# EAGLE schematic Схема основной платы (EAGLE 6.5.0)
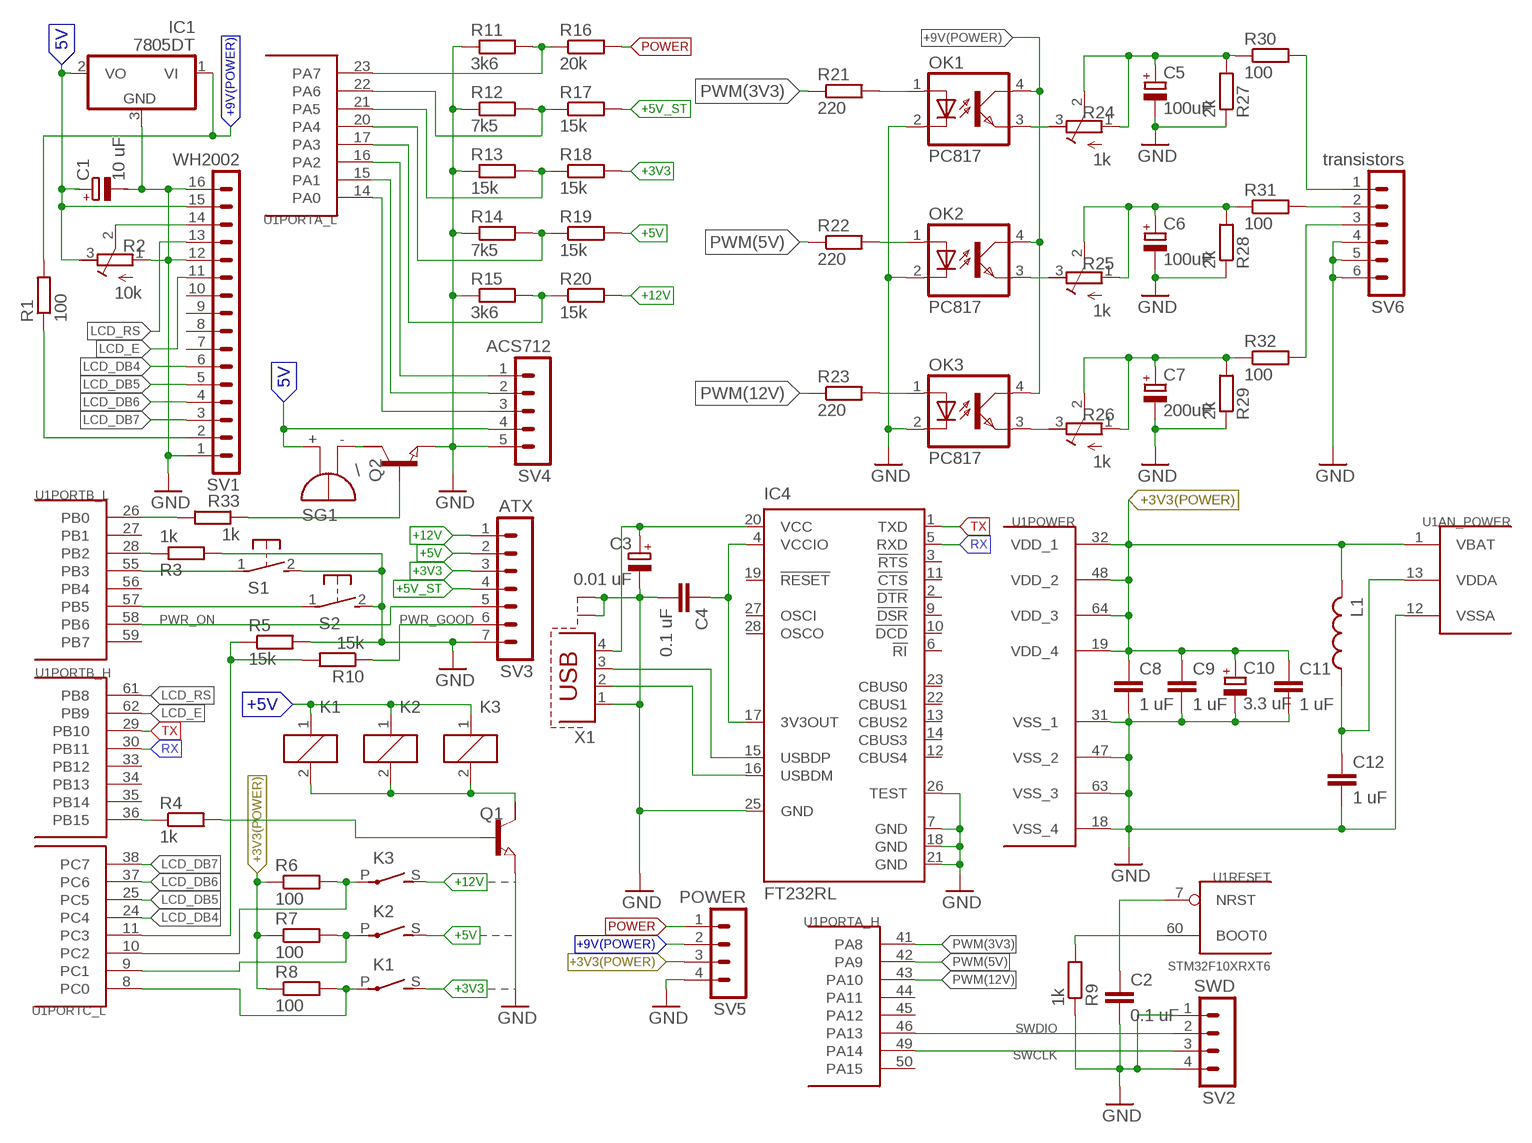
[diagram p0: schematic, sheet 1]

## Parts
C1  10 uF  CPOL-EU140CLH-0810  [140CLH-0810]
C2  0.1 uF  C-EUC1206  [C1206]
C3  0.01 uF  CPOL-EU140CLH-0810  [140CLH-0810]
C4  0.1 uF  C-EUC1206  [C1206]
C5  100uF  CPOL-EU140CLH-0810  [140CLH-0810]
C6  100uF  CPOL-EU140CLH-0810  [140CLH-0810]
C7  200uF  CPOL-EU140CLH-0810  [140CLH-0810]
C8  1 uF  C-EUC1206  [C1206]
C9  1 uF  C-EUC1206  [C1206]
C10  3.3 uF  CPOL-EU140CLH-0810  [140CLH-0810]
C11  1 uF  C-EUC1206  [C1206]
C12  1 uF  C-EUC1206  [C1206]
IC1  7805DT  [TO252]
IC4  FT232RL  [SSOP28]
K1  G2RA  [G2RA]
K2  G2RA  [G2RA]
K3  G2RA  [G2RA]
L1  L-USL1812  [L1812]
OK1  PC817  [DIL04]
OK2  PC817  [DIL04]
OK3  PC817  [DIL04]
Q1  NPN-TRANSISTIOR-2COLSOT89  [SOT89]
Q2  NPN-TRANSISTIOR-2COLSOT89  [SOT89]
R1  100  R-EU_M1206  [M1206]
R2  10k  R-TRIMM4G/J  [RTRIM4G/J]
R3  1k  R-EU_M1206  [M1206]
R4  1k  R-EU_M1206  [M1206]
R5  15k  R-EU_M1206  [M1206]
R6  100  R-EU_M1206  [M1206]
R7  100  R-EU_M1206  [M1206]
R8  100  R-EU_M1206  [M1206]
R9  1k  R-EU_R1206  [R1206]
R10  15k  R-EU_M1206  [M1206]
R11  3k6  R-EU_M1206  [M1206]
R12  7k5  R-EU_M1206  [M1206]
R13  15k  R-EU_M1206  [M1206]
R14  7k5  R-EU_M1206  [M1206]
R15  3k6  R-EU_M1206  [M1206]
R16  20k  R-EU_M1206  [M1206]
R17  15k  R-EU_M1206  [M1206]
R18  15k  R-EU_M1206  [M1206]
R19  15k  R-EU_M1206  [M1206]
R20  15k  R-EU_M1206  [M1206]
R21  220  R-EU_M1206  [M1206]
R22  220  R-EU_M1206  [M1206]
R23  220  R-EU_M1206  [M1206]
R24  1k  R-TRIMM4G/J  [RTRIM4G/J]
R25  1k  R-TRIMM4G/J  [RTRIM4G/J]
R26  1k  R-TRIMM4G/J  [RTRIM4G/J]
R27  2k  R-EU_M1206  [M1206]
R28  2k  R-EU_M1206  [M1206]
R29  2k  R-EU_M1206  [M1206]
R30  100  R-EU_M1206  [M1206]
R31  100  R-EU_M1206  [M1206]
R32  100  R-EU_M1206  [M1206]
R33  1k  R-EU_M1206  [M1206]
S1  31-XX  [B3F-31XX]
S2  31-XX  [B3F-31XX]
SG1  \  F/BC35  [F/BC35]
SV1  WH2002  MICS-16  [MICS-16]
SV2  SWD  MA04-1  [MA04-1]
SV3  ATX  MA07-1  [MA07-1]
SV4  ACS712  MA05-1  [MA05-1]
SV5  POWER  MA04-1  [MA04-1]
SV6  transistors  MA06-1  [MA06-1]
U1  STM32F10XRXT6  [TQFP64]
X1  PN61729-S  [PN61729-S]

## Nets
5V: C1.+ IC1.2(VO) R2.3(A) SG1.+ SV1.15 SV4.4
12V_RESIST: K3.P(2:P) R6.2 U1.10(PORTC_L:PC2)
+3V3: K1.S(2:S) R18.2 SV3.3
+3V3(POWER): C8.1 C9.1 C10.+ C11.1 L1.2 SV5.3 U1.1(AN_POWER:VBAT) U1.19(POWER:VDD_4) U1.32(POWER:VDD_1) U1.48(POWER:VDD_2) U1.64(POWER:VDD_3)
+5V: K1.1 K2.1 K2.S(2:S) K3.1 R19.2 SV3.2
+5V_ST: R17.2 SV3.4
+9V(POWER): IC1.1(VI) OK1.4(COL) OK2.4(COL) OK3.4(COL) R1.2 SV5.2
+12V: K3.S(2:S) R20.2 SV3.1
GATE1: R30.2 SV6.1
GND: C1.- C2.2 C3.- C4.2 C5.- C6.- C7.- C8.2 C9.2 C10.- C11.2 C12.2 IC1.3(GND) IC4.7(GND) IC4.18(GND) IC4.21(GND) IC4.25(GND) IC4.26(TEST) OK1.2(C) OK2.2(C) OK3.2(C) Q1.3(E) Q2.3(E) R2.1(E) R3.2 R5.2 R9.1 R11.1 R12.1 R13.1 R14.1 R15.1 R27.1 R28.1 R29.1 S1.2(S) S2.2(S) SV1.1 SV1.12 SV1.16 SV2.1 SV2.4 SV3.7 SV4.5 SV5.4 SV6.4 SV6.5 SV6.6 U1.12(AN_POWER:VSSA) U1.18(POWER:VSS_4) U1.31(POWER:VSS_1) U1.47(POWER:VSS_2) U1.63(POWER:VSS_3) X1.1 X1.S1 X1.S2
LCD_DB4: SV1.6 U1.24(PORTC_L:PC4)
LCD_DB5: SV1.5 U1.25(PORTC_L:PC5)
LCD_DB6: SV1.4 U1.37(PORTC_L:PC6)
LCD_DB7: SV1.3 U1.38(PORTC_L:PC7)
LCD_E: SV1.11 U1.62(PORTB_H:PB9)
LCD_RS: SV1.13 U1.61(PORTB_H:PB8)
N$1: C3.+ IC4.20(VCC) X1.4
N$2: R3.1 U1.28(PORTB_L:PB2)
N$3: S1.1(P) U1.55(PORTB_L:PB3)
N$4: S2.1(P) U1.57(PORTB_L:PB5)
N$5: R2.2(S) SV1.14
N$6: C4.1 IC4.4(VCCIO) IC4.17(3V3OUT)
N$7: R1.1 SV1.2
N$8: R5.1 R10.2 U1.11(PORTC_L:PC3)
N$9: R9.2 U1.60(RESET:BOOT0)
N$10: C2.1 U1.7(RESET:NRST)
N$11: Q2.2(C) SG1.-
N$12: SV4.1 U1.16(PORTA_L:PA2)
N$13: K1.P(2:P) R8.2 U1.8(PORTC_L:PC0)
N$14: SV4.2 U1.15(PORTA_L:PA1)
N$15: IC4.15(USBDP) X1.3
N$16: IC4.16(USBDM) X1.2
N$17: SV4.3 U1.14(PORTA_L:PA0)
N$18: C12.1 L1.1 U1.13(AN_POWER:VDDA)
N$19: C5.+ R24.1(E) R24.2(S) R27.2 R30.1
N$20: OK2.3(EMIT) R25.3(A)
N$21: R33.2 U1.26(PORTB_L:PB0)
N$23: K2.P(2:P) R7.2 U1.9(PORTC_L:PC1)
N$24: C6.+ R25.1(E) R25.2(S) R28.2 R31.1
N$25: OK3.3(EMIT) R26.3(A)
N$26: R4.1 U1.36(PORTB_H:PB15)
N$27: Q2.1(B) R33.1
N$28: C7.+ R26.1(E) R26.2(S) R29.2 R32.1
N$29: R32.2 SV6.3
N$30: R31.2 SV6.2
N$31: Q1.1(B) R4.2
N$32: K1.2 K2.2 K3.2 Q1.2(C)
N$34: R6.1 R7.1 R8.1
N$41: OK1.1(A) R21.2
N$42: OK2.1(A) R22.2
N$43: OK3.1(A) R23.2
N$44: OK1.3(EMIT) R24.3(A)
POWER: R16.2 SV5.1
PWM(3V3): R21.1 U1.41(PORTA_H:PA8)
PWM(5V): R22.1 U1.42(PORTA_H:PA9)
PWM(12V): R23.1 U1.43(PORTA_H:PA10)
PWR_GOOD: R10.1 SV3.6
PWR_ON: SV3.5 U1.58(PORTB_L:PB6)
RX: IC4.5(RXD) U1.30(PORTB_H:PB11)
SWCLK: SV2.3 U1.49(PORTA_H:PA14)
SWDIO: SV2.2 U1.46(PORTA_H:PA13)
TX: IC4.1(TXD) U1.29(PORTB_H:PB10)
VOLTAGE(3V3): R13.2 R18.1 U1.21(PORTA_L:PA5)
VOLTAGE(5V): R14.2 R19.1 U1.20(PORTA_L:PA4)
VOLTAGE(5VST): R12.2 R17.1 U1.22(PORTA_L:PA6)
VOLTAGE(12POWER): R11.2 R16.1 U1.23(PORTA_L:PA7)
VOLTAGE(12V): R15.2 R20.1 U1.17(PORTA_L:PA3)
Unconnected: IC4.2(!DTR) IC4.3(!RTS) IC4.6(!RI) IC4.9(!DSR) IC4.10(!DCD) IC4.11(!CTS) IC4.12(CBUS4) IC4.13(CBUS2) IC4.14(CBUS3) IC4.19(!RESET) IC4.22(CBUS1) IC4.23(CBUS0) IC4.27(OSCI) IC4.28(OSCO) Q1.2@1(C/) Q2.2@1(C/) SV1.7 SV1.8 SV1.9 SV1.10 U1.2(PORTC_H:PC13) U1.3(PORTC_H:PC14) U1.4(PORTC_H:PC15) U1.5(PORTD/OSC:PD0/OSC<=) U1.6(PORTD/OSC:PD1/OSC=>) U1.27(PORTB_L:PB1) U1.33(PORTB_H:PB12) U1.34(PORTB_H:PB13) U1.35(PORTB_H:PB14) U1.39(PORTC_H:PC8) U1.40(PORTC_H:PC9) U1.44(PORTA_H:PA11) U1.45(PORTA_H:PA12) U1.50(PORTA_H:PA15) U1.51(PORTC_H:PC10) U1.52(PORTC_H:PC11) U1.53(PORTC_H:PC12) U1.54(PORTD/OSC:PD2) U1.56(PORTB_L:PB4) U1.59(PORTB_L:PB7)

## Library data of the parts
C1 C3 C5-C7 C10 = resistor:CPOL-EU: POLARIZED CAPACITOR, European symbol
C2 C4 C8 C9 C11 C12 = resistor:C-EU: CAPACITOR, European symbol
IC1 = linear:78*: Positive VOLTAGE REGULATOR Source: http://cache.national.com/ds/LM/LM78L05.pdf http://www.fairchildsemi.com/ds/LM/LM7805.pdf
IC4 = ftdichip:FT232R: Source: http://www.ftdichip.com/Documents/DataSheets/DS_FT232R_v104.pdf; MPN: FT232RL; OC_FARNELL: 1146032; OC_NEWARK: 91K9918
K1-K3 = relay:G2RA: RELAY 1 x norm. open, Omron; OC_FARNELL: unknown; OC_NEWARK: unknown
L1 = resistor:L-US: INDUCTOR, American symbol
OK1-OK3 = optocoupler:PC817: SHARP OPTO COUPLER; MPN: PC817X4J000F; OC_FARNELL: 9707727; OC_NEWARK: 97K7059
Q1 Q2 = semicon-smd-ipc:NPN-TRANSISTIOR-2COL: NPN TRANSISTOR 2 colletor pins
R1 R3-R23 R27-R33 = resistor:R-EU_: RESISTOR, European symbol
R2 R24-R26 = resistor:R-TRIMM: Trimm resistor
S1 S2 = switch-omron:31-XX: OMRON SWITCH; MPN: B3F-3100; OC_FARNELL: 959704; OC_NEWARK: 36M3582
SG1 = buzzer:F/BC35: BUZZER Source: Spoerle; OC_FARNELL: unknown; OC_NEWARK: unknown
SV1 = con-lumberg:MICS-16: CONNECTOR; OC_FARNELL: unknown; OC_NEWARK: unknown
SV2 SV5 = con-lstb:MA04-1: PIN HEADER; OC_FARNELL: unknown; OC_NEWARK: unknown
SV3 = con-lstb:MA07-1: PIN HEADER; OC_FARNELL: unknown; OC_NEWARK: unknown
SV4 = con-lstb:MA05-1: PIN HEADER; OC_FARNELL: unknown; OC_NEWARK: unknown
SV6 = con-lstb:MA06-1: PIN HEADER; OC_FARNELL: unknown; OC_NEWARK: unknown
U1 = stm32:STM32F10XRXT6: STM32F101/103 64pin LQFP
X1 = con-berg:PN61729-S: BERG USB connector; OC_FARNELL: unknown; OC_NEWARK: unknown